# Altium schematic sheet FPGA_DECOUP.SchDoc
size A3; SheetNumber: 7; SheetTotal: 9
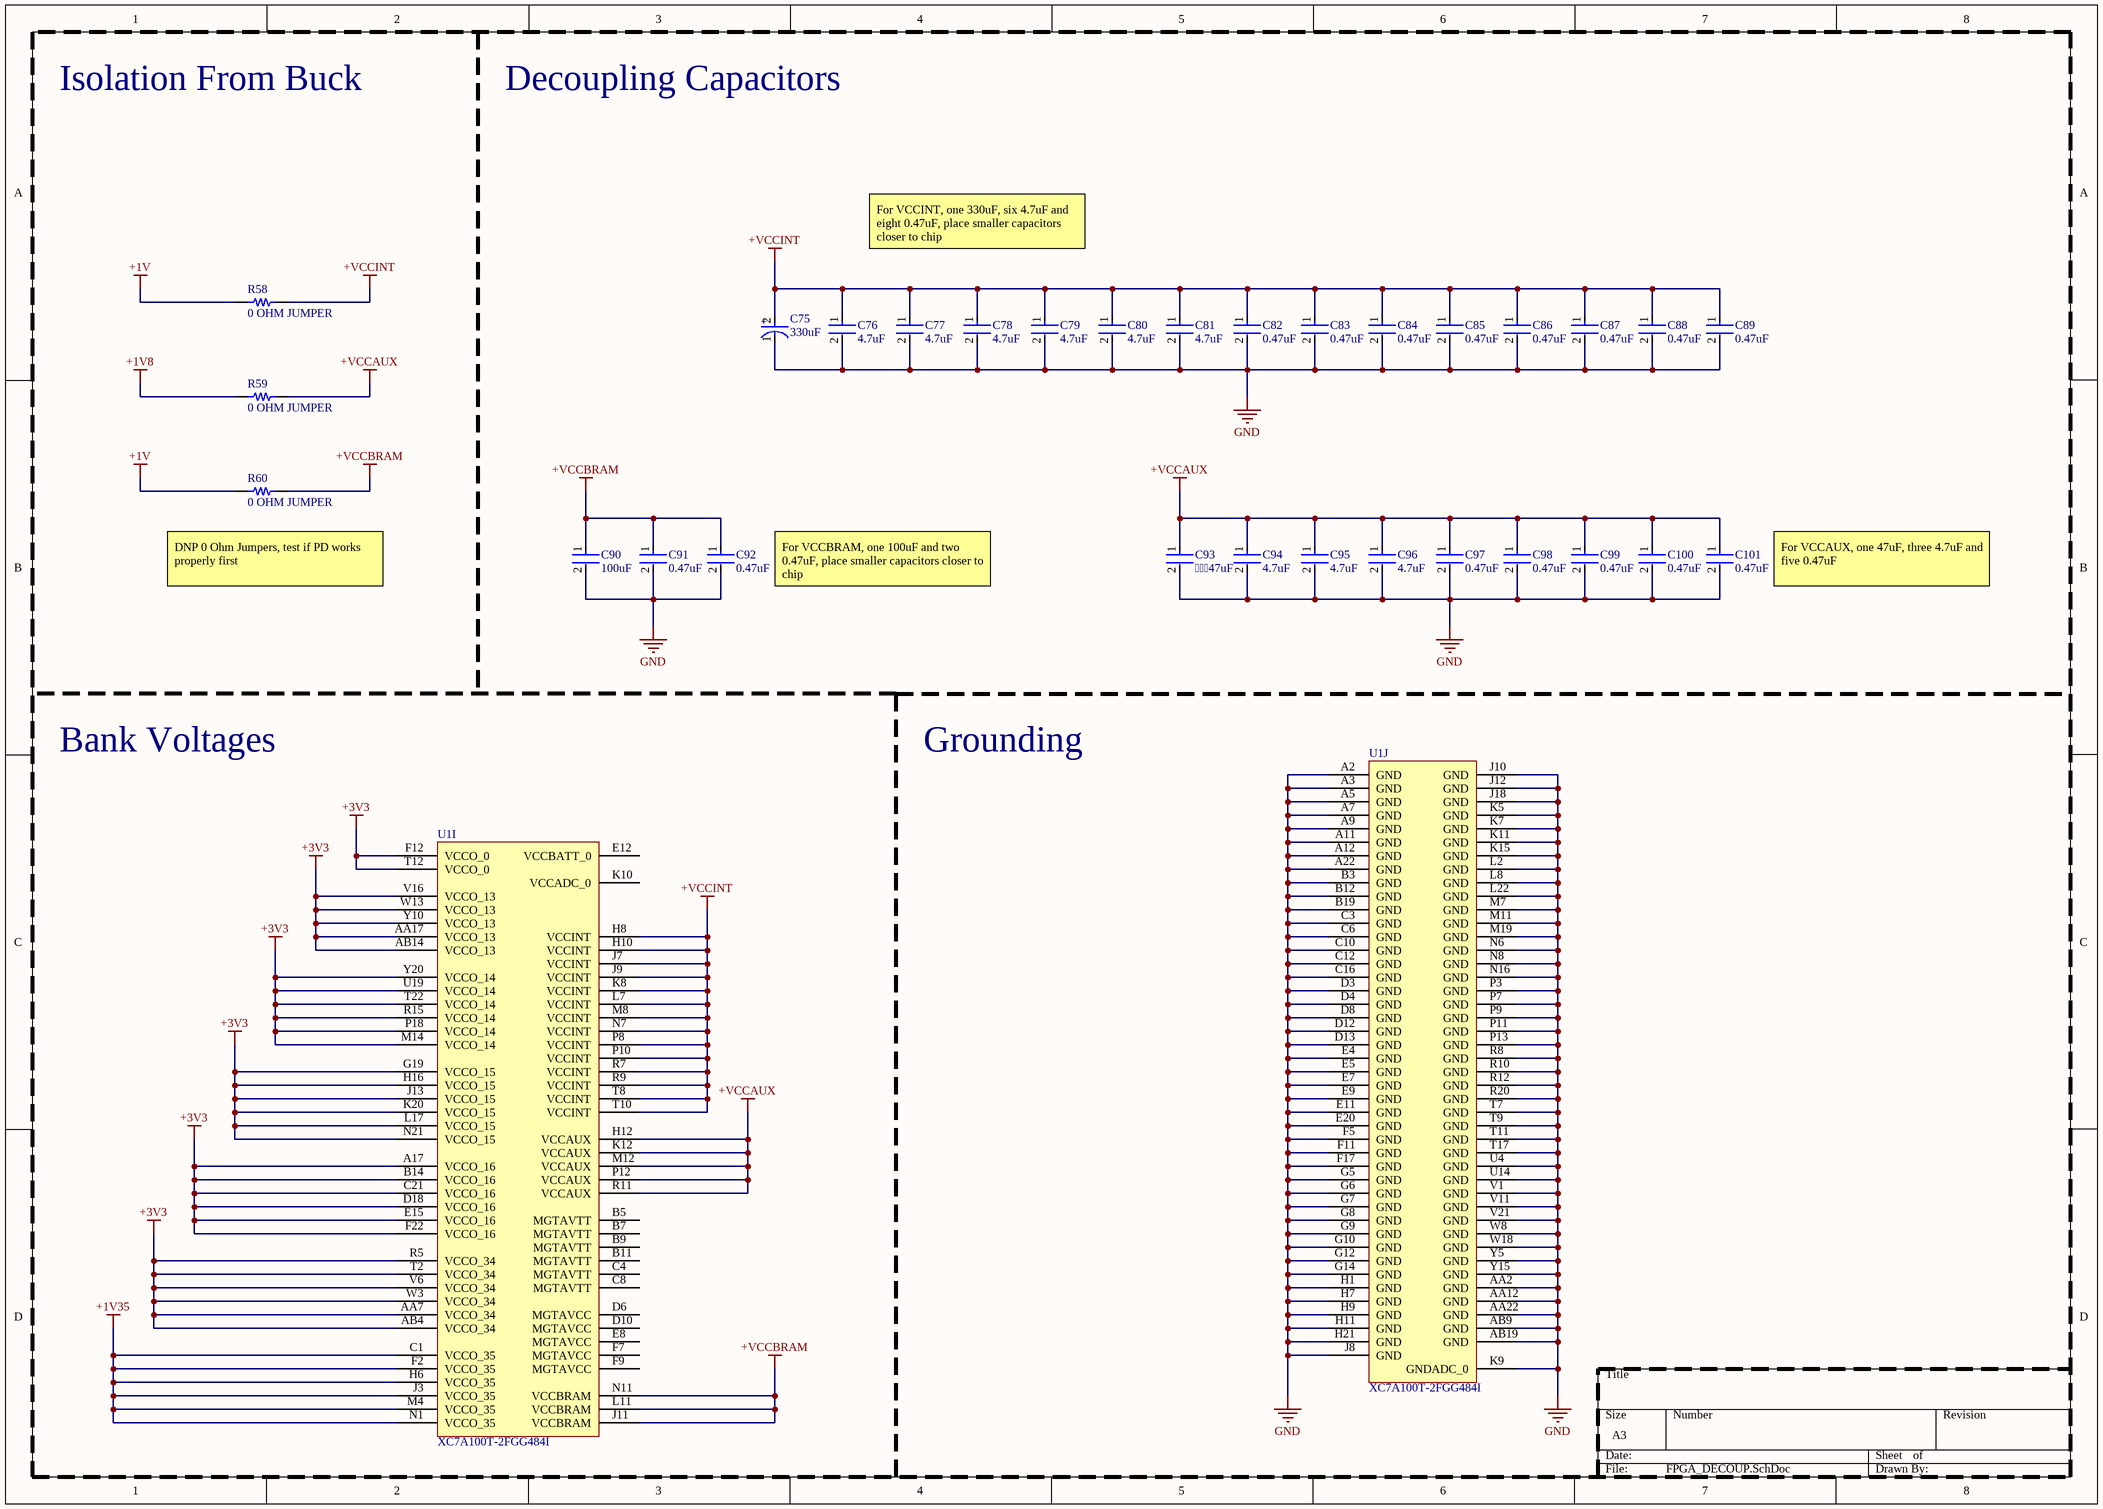
[diagram p0: FPGA_DECOUP.SchDoc]

## Parts
C75  330uF  [FP-T495X336M035ATE100-MFG]
C76  4.7uF  [FP-GRM155-0_1-IPC_B]
C77  4.7uF  [FP-GRM155-0_1-IPC_B]
C78  4.7uF  [FP-GRM155-0_1-IPC_B]
C79  4.7uF  [FP-GRM155-0_1-IPC_B]
C80  4.7uF  [FP-GRM155-0_1-IPC_B]
C81  4.7uF  [FP-GRM155-0_1-IPC_B]
C82  0.47uF  [FP-GRM15-0_1-MFG]
C83  0.47uF  [FP-GRM15-0_1-MFG]
C84  0.47uF  [FP-GRM15-0_1-MFG]
C85  0.47uF  [FP-GRM15-0_1-MFG]
C86  0.47uF  [FP-GRM15-0_1-MFG]
C87  0.47uF  [FP-GRM15-0_1-MFG]
C88  0.47uF  [FP-GRM15-0_1-MFG]
C89  0.47uF  [FP-GRM15-0_1-MFG]
C90  100uF  [FP-GRM32E-0_3-0_2-IPC_B]
C91  0.47uF  [FP-GRM15-0_1-MFG]
C92  0.47uF  [FP-GRM15-0_1-MFG]
C93  47uF  [FP-GRM32E-0_3-0_2-MFG]
C94  4.7uF  [FP-GRM155-0_1-IPC_B]
C95  4.7uF  [FP-GRM155-0_1-IPC_B]
C96  4.7uF  [FP-GRM155-0_1-IPC_B]
C97  0.47uF  [FP-GRM15-0_1-MFG]
C98  0.47uF  [FP-GRM15-0_1-MFG]
C99  0.47uF  [FP-GRM15-0_1-MFG]
C100  0.47uF  [FP-GRM15-0_1-MFG]
C101  0.47uF  [FP-GRM15-0_1-MFG]
R58  0 OHM JUMPER  [RES 0603_1608]
R59  0 OHM JUMPER  [RES 0603_1608]
R60  0 OHM JUMPER  [RES 0603_1608]
U1  XC7A100T-2FGG484I  [FGG484]  (parts I,J of 10)

## Nets
+1V: R58.1 R60.1
+1V8: R59.1
+1V35: U1.C1(VCCO_35) U1.F2(VCCO_35) U1.H6(VCCO_35) U1.J3(VCCO_35) U1.M4(VCCO_35) U1.N1(VCCO_35)
+3V3: U1.A17(VCCO_16) U1.AA7(VCCO_34) U1.AA17(VCCO_13) U1.AB4(VCCO_34) U1.AB14(VCCO_13) U1.B14(VCCO_16) U1.C21(VCCO_16) U1.D18(VCCO_16) U1.E15(VCCO_16) U1.F12(VCCO_0) U1.F22(VCCO_16) U1.G19(VCCO_15) U1.H16(VCCO_15) U1.J13(VCCO_15) U1.K20(VCCO_15) U1.L17(VCCO_15) U1.M14(VCCO_14) U1.N21(VCCO_15) U1.P18(VCCO_14) U1.R5(VCCO_34) U1.R15(VCCO_14) U1.T2(VCCO_34) U1.T12(VCCO_0) U1.T22(VCCO_14) U1.U19(VCCO_14) U1.V6(VCCO_34) U1.V16(VCCO_13) U1.W3(VCCO_34) U1.W13(VCCO_13) U1.Y10(VCCO_13) U1.Y20(VCCO_14)
+VCCAUX: C93.1 C94.1 C95.1 C96.1 C97.1 C98.1 C99.1 C100.1 C101.1 R59.2 U1.H12(VCCAUX) U1.K12(VCCAUX) U1.M12(VCCAUX) U1.P12(VCCAUX) U1.R11(VCCAUX)
+VCCBRAM: C90.1 C91.1 C92.1 R60.2 U1.J11(VCCBRAM) U1.L11(VCCBRAM) U1.N11(VCCBRAM)
+VCCINT: C75.2(A) C76.1 C77.1 C78.1 C79.1 C80.1 C81.1 C82.1 C83.1 C84.1 C85.1 C86.1 C87.1 C88.1 C89.1 R58.2 U1.H8(VCCINT) U1.H10(VCCINT) U1.J7(VCCINT) U1.J9(VCCINT) U1.K8(VCCINT) U1.L7(VCCINT) U1.M8(VCCINT) U1.N7(VCCINT) U1.P8(VCCINT) U1.P10(VCCINT) U1.R7(VCCINT) U1.R9(VCCINT) U1.T8(VCCINT) U1.T10(VCCINT)
GND: C75.1(C) C76.2 C77.2 C78.2 C79.2 C80.2 C81.2 C82.2 C83.2 C84.2 C85.2 C86.2 C87.2 C88.2 C89.2 C90.2 C91.2 C92.2 C93.2 C94.2 C95.2 C96.2 C97.2 C98.2 C99.2 C100.2 C101.2 U1.A2(GND) U1.A3(GND) U1.A5(GND) U1.A7(GND) U1.A9(GND) U1.A11(GND) U1.A12(GND) U1.A22(GND) U1.AA2(GND) U1.AA12(GND) U1.AA22(GND) U1.AB9(GND) U1.AB19(GND) U1.B3(GND) U1.B12(GND) U1.B19(GND) U1.C3(GND) U1.C6(GND) U1.C10(GND) U1.C12(GND) U1.C16(GND) U1.D3(GND) U1.D4(GND) U1.D8(GND) U1.D12(GND) U1.D13(GND) U1.E4(GND) U1.E5(GND) U1.E7(GND) U1.E9(GND) U1.E11(GND) U1.E20(GND) U1.F5(GND) U1.F11(GND) U1.F17(GND) U1.G5(GND) U1.G6(GND) U1.G7(GND) U1.G8(GND) U1.G9(GND) U1.G10(GND) U1.G12(GND) U1.G14(GND) U1.H1(GND) U1.H7(GND) U1.H9(GND) U1.H11(GND) U1.H21(GND) U1.J8(GND) U1.J10(GND) U1.J12(GND) U1.J18(GND) U1.K5(GND) U1.K7(GND) U1.K9(GNDADC_0) U1.K11(GND) U1.K15(GND) U1.L2(GND) U1.L8(GND) U1.L22(GND) U1.M7(GND) U1.M11(GND) U1.M19(GND) U1.N6(GND) U1.N8(GND) U1.N16(GND) U1.P3(GND) U1.P7(GND) U1.P9(GND) U1.P11(GND) U1.P13(GND) U1.R8(GND) U1.R10(GND) U1.R12(GND) U1.R20(GND) U1.T7(GND) U1.T9(GND) U1.T11(GND) U1.T17(GND) U1.U4(GND) U1.U14(GND) U1.V1(GND) U1.V11(GND) U1.V21(GND) U1.W8(GND) U1.W18(GND) U1.Y5(GND) U1.Y15(GND)

Not connected (* = marked no-connect by the designer): U1 B5(MGTAVTT) B7(MGTAVTT) B9(MGTAVTT) B11(MGTAVTT) C4(MGTAVTT) C8(MGTAVTT) D6(MGTAVCC) D10(MGTAVCC) E8(MGTAVCC) E12(VCCBATT_0) F7(MGTAVCC) F9(MGTAVCC) K10(VCCADC_0)

## Notes on the sheet
- Isolation From Buck
- Decoupling Capacitors
- For VCCINT, one 330uF, six 4.7uF and eight 0.47uF, place smaller capacitors closer to chip
- (near R60) DNP 0 Ohm Jumpers, test if PD works properly first
- For VCCBRAM, one 100uF and two 0.47uF, place smaller capacitors closer to chip
- For VCCAUX, one 47uF, three 4.7uF and five 0.47uF
- Bank Voltages
- Grounding
- (in symbol CMP-03017-000065-1) +

## Library data of the parts
C75 = CMP-03017-000065-1: CAP TANT 33UF 20% 35V 2917; Polarity: Polar; Dissipation Factor: 6%; ESR (Equivalent Series Resistance): 100mR; Case Code (Imperial): 2917; Termination: SMD/SMT; Radiation Hardening: No; Width: 4.3mm; Case Code (Metric): 7343; Depth: 4.3mm; Height: 4.3mm; Capacitance: 33uF; Series: T495; Max Operating Temperature: 125°C; Voltage Rating (DC): 35V; Construction: Flat; Min Operating Temperature: -55°C; Packaging: Tape and Reel; Length: 7.3mm; RoHS Compliant: Yes; Tolerance: 20%; Case/Package: Molded; Weight: 0.023634oz; Voltage Rating: 35V
C76-C81 C94-C96 = CMP-2008-04549-2: Chip Multilayer Ceramic Capacitors for General Purpose, 0402, 4.7uF, X5R, 15%, 20%, 6.3V; Height: 0.5mm; Weight: 0.000212oz; Length: 1mm; Case Code (Metric): 1005; Packaging: Tape and Reel; Termination: SMD/SMT; Dielectric: X5R; Depth: 0.5mm; Case Code (Imperial): 0402; Min Operating Temperature: -55°C; Case/Package: 0402; Voltage: 6.3V; Width: 0.02inch; Capacitance: 4.7uF; Lead Free: Lead Free; Thickness: 0.022inch; Contact Plating: Tin; REACH SVHC: No SVHC; Package Quantity: 10000; Tolerance: 20%; Voltage Rating (DC): 6.3V; Voltage Rating: 6.3V; Mount: Surface Mount; Max Operating Temperature: 85°C
C82-C89 C91 C92 C97-C101 = CMP-2000-05009-2: CAP CER 0.47UF 10V X5R 0402; Manufacturer: Murata Electronics North America; Manufacturer Part Number: GRM155R61A474KE15D; Temperature Coefficient: 15%; Material: Ceramic; Tolerance: 10%; Description: 0.47µF ±10% 10V Ceramic Capacitor X5R 0402 (1005 Metric); Device Class L3: Ceramic Capacitors; ComponentLink2Description: Datasheet; ComponentLink2URL: https://search.murata.co.jp/Ceramy/image/img/A01X/G101/ENG/GRM155R61A474KE15-01A.pdf; Package: GRM15-0.1; Voltage Rating: 10V; Capacitance: 0.47uF; Category: Cap; Temperature Range High: +85°C; Temperature Range Low: -55°C; Height: 0.55mm; Device Class L2: Capacitors; Lead Free: Yes; Mouser Description: Multilayer Ceramic Capacitors MLCC - SMD/SMT 0402 0.47uF 10volts X5R 10%; Ipc Land Pattern Name: CAPC10050X50; Temperature Characteristic: X5R; Digikey Description: CAP CER 0.47UF 10V X5R 0402; Value: 0.47uF; Octopart: https://octopart.com/grm155r61a474ke15d-murata-196883; Automotive: No; Device Class L1: Passive Components; Temperature: -55°C to +85°C; RoHS: TRUE
C90 = CMP-06035-048205-1: Chip Multilayer Ceramic Capacitors for General Purpose, 1210, 100uF, X5R, 15%, 20%, 10V; Dissipation Factor: 0.035%; Packaging: Tape and Reel; Width: 2.5mm; Case/Package: 1210; Min Operating Temperature: -55°C; Depth: 2.5mm; Package Quantity: 1000; Case Code (Imperial): 1210; Voltage Rating: 10V; Dielectric Material: Ceramic; Length: 3.2mm; Lead Free: Lead Free; REACH SVHC: No SVHC; Mount: Surface Mount; Height: 2.5mm; Voltage Rating (DC): 10V; Dielectric: X5R; Thickness: 0.106inch; Weight: 0.00388oz; Material: Ceramic; Termination: SMD/SMT; Tolerance: 20%; Case Code (Metric): 3225; Voltage: 10V; Max Operating Temperature: 85°C; Capacitance: 100uF
C93 = CMP-2000-06360-2: CAP CER 47UF 6.3V X5R 1210; Dielectric Material: Ceramic; Insulation Resistance: 10.6MR; Tolerance: 10%; REACH SVHC: No SVHC; Package Quantity: 1; Radiation Hardening: No; Construction: Flat; Voltage Rating: 6.3V; Min Operating Temperature: -55°C; Packaging: Tape and Reel; RoHS Compliant: Yes; Height: 2.5mm; Case Code (Imperial): 1210; Mount: Surface Mount; Max Operating Temperature: 85°C; Width: 2.5mm; Dielectric: X5R; Length: 3.2mm; Thickness: 0.106inch; Lead Free: Lead Free; Series: GRM; Voltage Rating (DC): 6.3V; Termination: SMD/SMT; Case Code (Metric): 3225; Capacitance: 47uF; Weight: 0.000564oz; Case/Package: 1210; Voltage: 6.3V; Depth: 2.5mm
R58-R60 = CMP-010-0000-7: Fixed Resistor, Metal Glaze/thick Film, 0.1W, 0ohm, Surface Mount, 0603; Voltage Rating: 75V; Temperature Coefficient: 0ppm/°C; Case/Package: 0603
U1 = CMP-0364-00030-3: Artix-7 FPGA, 285 User I/Os, 4 GTP, 484-Ball BGA, Speed Grade 2, Industrial Grade, Pb-Free; Manufacturer: Xilinx; DSP48E1 Slices: 240; Speed Grade: -2; Clock Mgmt Tiles (CMTs): 6; Block RAM Blocks (Max Kb): 4860; Max User I/O: 300; Block RAM Blocks (18Kb): 270; CLBs (Slices): 15850; Logic Cells: 101440; Block RAM Blocks (36Kb): 135; ComponentLink2URL: http://www.xilinx.com/support/documentation/user_guides/ug475_7Series_Pkg_Pinout.pdf; DatasheetVersion: v1.12; PartNumber: XC7A100T-2FGG484I; ComponentLink5Description: Packaging and Pinout; PackageDescription: Wire-Bond Fine-Pitch BGA, Body 23 x 23 mm, 1.0 mm Pitch; Mounting Technology: Surface Mount; ComponentLink1Description: Datasheet; ComponentLink4URL: http://www.xilinx.com/support/packagefiles/a7packages/xc7a100tfgg484pkg.txt; PackageVersion: Rev 1.8; NexusDeviceID: XC7A100T-2FGG484I; ComponentLink5URL: http://www.xilinx.com/support/documentation/user_guides/ug475_7Series_Pkg_Pinout.pdf; Code_JEDEC: MS-034-AAJ-1; Generic Part Number: XC7A100T; ComponentLink4Description: Package File; ComponentLink3Description: DC and Switching Characteristics; ComponentLink1URL: http://www.xilinx.com/support/documentation/data_sheets/ds180_7Series_Overview.pdf; CLBs (Max Distributed RAM Kb): 1188; ComponentLink2Description: Package Specification; RoHS: Pb-Free; ComponentLink3URL: http://www.xilinx.com/support/documentation/data_sheets/ds181_Artix_7_Data_Sheet.pdf; PackageReference: FGG484